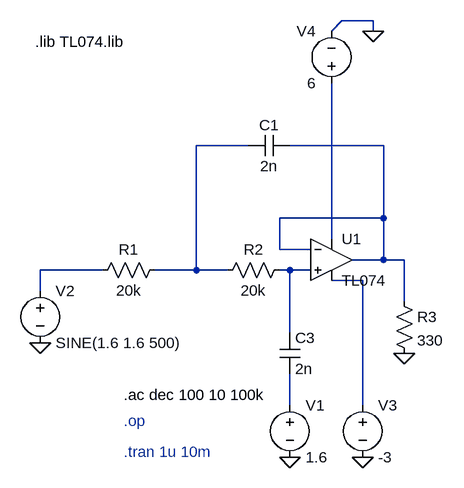
[diagram p0: schematic lpf.asc]
lpf.asc, the LTspice schematic file:
Version 4
SHEET 1 880 1680
WIRE 240 992 192 992
WIRE 176 1008 192 992
WIRE 240 1008 240 992
WIRE 48 1184 -32 1184
WIRE 256 1184 112 1184
WIRE 256 1296 256 1184
WIRE 256 1296 96 1296
WIRE 176 1328 176 1088
WIRE 96 1344 96 1296
WIRE 144 1344 96 1344
WIRE 256 1360 256 1296
WIRE 256 1360 208 1360
WIRE 288 1360 256 1360
WIRE -176 1376 -272 1376
WIRE -32 1376 -32 1184
WIRE -32 1376 -96 1376
WIRE 16 1376 -32 1376
WIRE 112 1376 96 1376
WIRE 144 1376 112 1376
WIRE 224 1392 176 1392
WIRE -272 1408 -272 1376
WIRE 288 1424 288 1360
WIRE 112 1472 112 1376
WIRE 112 1584 112 1536
WIRE 224 1584 224 1392
FLAG -272 1488 0
FLAG 112 1664 0
FLAG 224 1664 0
FLAG 240 1008 0
FLAG 288 1504 0
SYMBOL Res -80 1360 R90
WINDOW 0 0 56 VBottom 2
WINDOW 3 32 56 VTop 2
SYMATTR InstName R1
SYMATTR Value 20k
SYMBOL Res 112 1360 R90
WINDOW 0 0 56 VBottom 2
WINDOW 3 32 56 VTop 2
SYMATTR InstName R2
SYMATTR Value 20k
SYMBOL cap 112 1168 R90
WINDOW 0 0 32 VBottom 2
WINDOW 3 32 32 VTop 2
SYMATTR InstName C1
SYMATTR Value 2n
SYMATTR SpiceLine Rser=52.6m Lser=228p mfg="   ---" pn="   ---" type="   ---"
SYMBOL OpAmps/opamp2 176 1296 R0
SYMATTR InstName U1
SYMATTR Value TL074
SYMBOL cap 96 1472 R0
SYMATTR InstName C3
SYMATTR Value 2n
SYMATTR SpiceLine Rser=52.5m Lser=416p mfg="   ---" pn="   ---" type="   ---"
SYMBOL voltage 112 1568 R0
SYMATTR InstName V1
SYMATTR Value 1.6
SYMBOL voltage -272 1392 R0
SYMATTR InstName V2
SYMATTR Value SINE(1.6 1.6 500)
SYMATTR Value2 AC 1.6
SYMBOL voltage 176 1104 R180
WINDOW 0 24 96 Left 2
WINDOW 3 24 16 Left 2
SYMATTR InstName V4
SYMATTR Value 6
SYMBOL voltage 224 1568 R0
SYMATTR InstName V3
SYMATTR Value -3
SYMBOL Res 272 1408 R0
SYMATTR InstName R3
SYMATTR Value 330
TEXT -144 1568 Left 2 !.ac dec 100 10 100k
TEXT -144 1608 Left 2 ;.op
TEXT -144 1656 Left 2 ;.tran 1u 10m
TEXT -280 1024 Left 2 !.lib TL074.lib

The netlist it stands for:
* lpf.asc
R1 N001 N004 20k
R2 N005 N001 20k
C1 N002 N001 2n Rser=52.6m Lser=228p mfg="   ---" pn="   ---" type="   ---"
XU1 N005 N002 N003 N006 N002 TL074  ; pins In+ In- V+ V- OUT
C3 N005 N007 2n Rser=52.5m Lser=416p mfg="   ---" pn="   ---" type="   ---"
V1 N007 0 1.6
V2 N004 0 SINE(1.6 1.6 500) AC 1.6
V4 N003 0 6
V3 N006 0 -3
R3 N002 0 330
.ac dec 100 10 100k
* .op
* .tran 1u 10m
.lib TL074.lib
.backanno
.end